# Altium project PCB_Project.PrjPcb
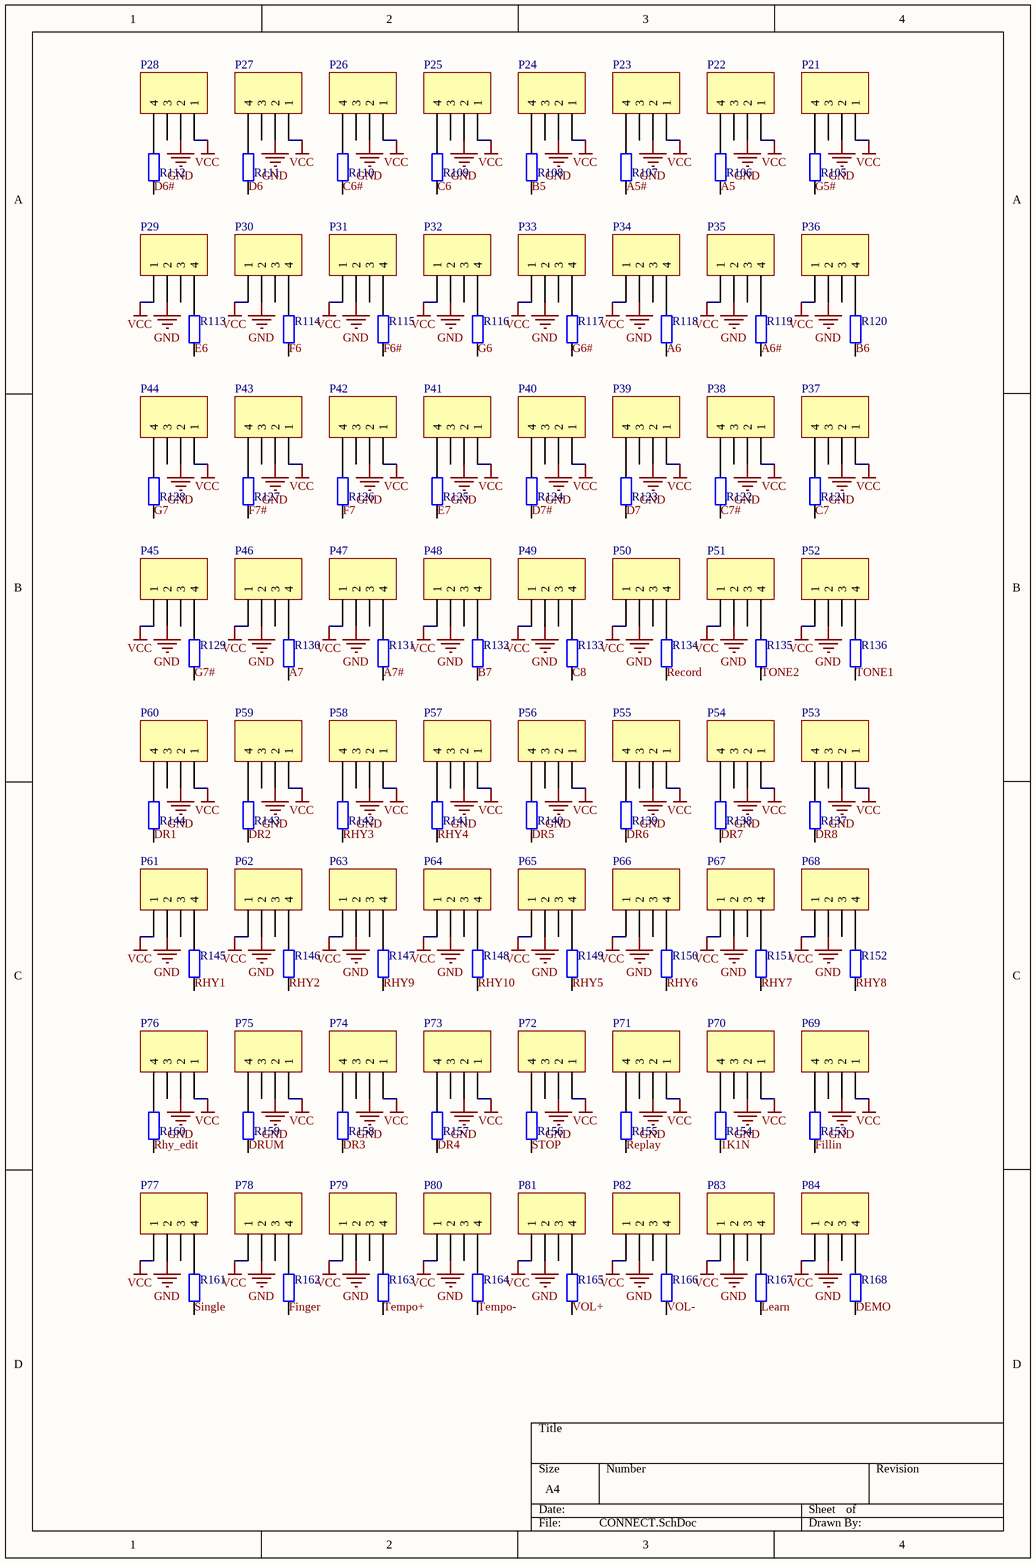
[diagram p0: CONNECT.SchDoc]
3 sheets, 349 parts. Net scope: global (net labels, ports and power ports of the same name join across sheets).
Board file: Connect.PcbDoc
Sheets:
  CONNECT.SchDoc
  CONNECT2.SchDoc
  Sheet3.SchDoc

## Sheet CONNECT.SchDoc
size A4 portrait

### Parts
P21  Header 4  [FPC1.0-2H-WS-4P]  (value not drawn)
P22  Header 4  [FPC1.0-2H-WS-4P]  (value not drawn)
P23  Header 4  [FPC1.0-2H-WS-4P]  (value not drawn)
P24  Header 4  [FPC1.0-2H-WS-4P]  (value not drawn)
P25  Header 4  [FPC1.0-2H-WS-4P]  (value not drawn)
P26  Header 4  [FPC1.0-2H-WS-4P]  (value not drawn)
P27  Header 4  [FPC1.0-2H-WS-4P]  (value not drawn)
P28  Header 4  [FPC1.0-2H-WS-4P]  (value not drawn)
P29  Header 4  [FPC1.0-2H-WS-4P]  (value not drawn)
P30  Header 4  [FPC1.0-2H-WS-4P]  (value not drawn)
P31  Header 4  [FPC1.0-2H-WS-4P]  (value not drawn)
P32  Header 4  [FPC1.0-2H-WS-4P]  (value not drawn)
P33  Header 4  [FPC1.0-2H-WS-4P]  (value not drawn)
P34  Header 4  [FPC1.0-2H-WS-4P]  (value not drawn)
P35  Header 4  [FPC1.0-2H-WS-4P]  (value not drawn)
P36  Header 4  [FPC1.0-2H-WS-4P]  (value not drawn)
P37  Header 4  [FPC1.0-2H-WS-4P]  (value not drawn)
P38  Header 4  [FPC1.0-2H-WS-4P]  (value not drawn)
P39  Header 4  [FPC1.0-2H-WS-4P]  (value not drawn)
P40  Header 4  [FPC1.0-2H-WS-4P]  (value not drawn)
P41  Header 4  [FPC1.0-2H-WS-4P]  (value not drawn)
P42  Header 4  [FPC1.0-2H-WS-4P]  (value not drawn)
P43  Header 4  [FPC1.0-2H-WS-4P]  (value not drawn)
P44  Header 4  [FPC1.0-2H-WS-4P]  (value not drawn)
P45  Header 4  [FPC1.0-2H-WS-4P]  (value not drawn)
P46  Header 4  [FPC1.0-2H-WS-4P]  (value not drawn)
P47  Header 4  [FPC1.0-2H-WS-4P]  (value not drawn)
P48  Header 4  [FPC1.0-2H-WS-4P]  (value not drawn)
P49  Header 4  [FPC1.0-2H-WS-4P]  (value not drawn)
P50  Header 4  [FPC1.0-2H-WS-4P]  (value not drawn)
P51  Header 4  [FPC1.0-2H-WS-4P]  (value not drawn)
P52  Header 4  [FPC1.0-2H-WS-4P]  (value not drawn)
P53  Header 4  [FPC1.0-2H-WS-4P]  (value not drawn)
P54  Header 4  [FPC1.0-2H-WS-4P]  (value not drawn)
P55  Header 4  [FPC1.0-2H-WS-4P]  (value not drawn)
P56  Header 4  [FPC1.0-2H-WS-4P]  (value not drawn)
P57  Header 4  [FPC1.0-2H-WS-4P]  (value not drawn)
P58  Header 4  [FPC1.0-2H-WS-4P]  (value not drawn)
P59  Header 4  [FPC1.0-2H-WS-4P]  (value not drawn)
P60  Header 4  [FPC1.0-2H-WS-4P]  (value not drawn)
P61  Header 4  [FPC1.0-2H-WS-4P]  (value not drawn)
P62  Header 4  [FPC1.0-2H-WS-4P]  (value not drawn)
P63  Header 4  [FPC1.0-2H-WS-4P]  (value not drawn)
P64  Header 4  [FPC1.0-2H-WS-4P]  (value not drawn)
P65  Header 4  [FPC1.0-2H-WS-4P]  (value not drawn)
P66  Header 4  [FPC1.0-2H-WS-4P]  (value not drawn)
P67  Header 4  [FPC1.0-2H-WS-4P]  (value not drawn)
P68  Header 4  [FPC1.0-2H-WS-4P]  (value not drawn)
P69  Header 4  [FPC1.0-2H-WS-4P]  (value not drawn)
P70  Header 4  [FPC1.0-2H-WS-4P]  (value not drawn)
P71  Header 4  [FPC1.0-2H-WS-4P]  (value not drawn)
P72  Header 4  [FPC1.0-2H-WS-4P]  (value not drawn)
P73  Header 4  [FPC1.0-2H-WS-4P]  (value not drawn)
P74  Header 4  [FPC1.0-2H-WS-4P]  (value not drawn)
P75  Header 4  [FPC1.0-2H-WS-4P]  (value not drawn)
P76  Header 4  [FPC1.0-2H-WS-4P]  (value not drawn)
P77  Header 4  [FPC1.0-2H-WS-4P]  (value not drawn)
P78  Header 4  [FPC1.0-2H-WS-4P]  (value not drawn)
P79  Header 4  [FPC1.0-2H-WS-4P]  (value not drawn)
P80  Header 4  [FPC1.0-2H-WS-4P]  (value not drawn)
P81  Header 4  [FPC1.0-2H-WS-4P]  (value not drawn)
P82  Header 4  [FPC1.0-2H-WS-4P]  (value not drawn)
P83  Header 4  [FPC1.0-2H-WS-4P]  (value not drawn)
P84  Header 4  [FPC1.0-2H-WS-4P]  (value not drawn)
R105  1KΩ (1001) ±1%  [0603_R]  (value not drawn)
R106  1KΩ (1001) ±1%  [0603_R]  (value not drawn)
R107  1KΩ (1001) ±1%  [0603_R]  (value not drawn)
R108  1KΩ (1001) ±1%  [0603_R]  (value not drawn)
R109  1KΩ (1001) ±1%  [0603_R]  (value not drawn)
R110  1KΩ (1001) ±1%  [0603_R]  (value not drawn)
R111  1KΩ (1001) ±1%  [0603_R]  (value not drawn)
R112  1KΩ (1001) ±1%  [0603_R]  (value not drawn)
R113  1KΩ (1001) ±1%  [0603_R]  (value not drawn)
R114  1KΩ (1001) ±1%  [0603_R]  (value not drawn)
R115  1KΩ (1001) ±1%  [0603_R]  (value not drawn)
R116  1KΩ (1001) ±1%  [0603_R]  (value not drawn)
R117  1KΩ (1001) ±1%  [0603_R]  (value not drawn)
R118  1KΩ (1001) ±1%  [0603_R]  (value not drawn)
R119  1KΩ (1001) ±1%  [0603_R]  (value not drawn)
R120  1KΩ (1001) ±1%  [0603_R]  (value not drawn)
R121  1KΩ (1001) ±1%  [0603_R]  (value not drawn)
R122  1KΩ (1001) ±1%  [0603_R]  (value not drawn)
R123  1KΩ (1001) ±1%  [0603_R]  (value not drawn)
R124  1KΩ (1001) ±1%  [0603_R]  (value not drawn)
R125  1KΩ (1001) ±1%  [0603_R]  (value not drawn)
R126  1KΩ (1001) ±1%  [0603_R]  (value not drawn)
R127  1KΩ (1001) ±1%  [0603_R]  (value not drawn)
R128  1KΩ (1001) ±1%  [0603_R]  (value not drawn)
R129  1KΩ (1001) ±1%  [0603_R]  (value not drawn)
R130  1KΩ (1001) ±1%  [0603_R]  (value not drawn)
R131  1KΩ (1001) ±1%  [0603_R]  (value not drawn)
R132  1KΩ (1001) ±1%  [0603_R]  (value not drawn)
R133  1KΩ (1001) ±1%  [0603_R]  (value not drawn)
R134  1KΩ (1001) ±1%  [0603_R]  (value not drawn)
R135  1KΩ (1001) ±1%  [0603_R]  (value not drawn)
R136  1KΩ (1001) ±1%  [0603_R]  (value not drawn)
R137  1KΩ (1001) ±1%  [0603_R]  (value not drawn)
R138  1KΩ (1001) ±1%  [0603_R]  (value not drawn)
R139  1KΩ (1001) ±1%  [0603_R]  (value not drawn)
R140  1KΩ (1001) ±1%  [0603_R]  (value not drawn)
R141  1KΩ (1001) ±1%  [0603_R]  (value not drawn)
R142  1KΩ (1001) ±1%  [0603_R]  (value not drawn)
R143  1KΩ (1001) ±1%  [0603_R]  (value not drawn)
R144  1KΩ (1001) ±1%  [0603_R]  (value not drawn)
R145  1KΩ (1001) ±1%  [0603_R]  (value not drawn)
R146  1KΩ (1001) ±1%  [0603_R]  (value not drawn)
R147  1KΩ (1001) ±1%  [0603_R]  (value not drawn)
R148  1KΩ (1001) ±1%  [0603_R]  (value not drawn)
R149  1KΩ (1001) ±1%  [0603_R]  (value not drawn)
R150  1KΩ (1001) ±1%  [0603_R]  (value not drawn)
R151  1KΩ (1001) ±1%  [0603_R]  (value not drawn)
R152  1KΩ (1001) ±1%  [0603_R]  (value not drawn)
R153  1KΩ (1001) ±1%  [0603_R]  (value not drawn)
R154  1KΩ (1001) ±1%  [0603_R]  (value not drawn)
R155  1KΩ (1001) ±1%  [0603_R]  (value not drawn)
R156  1KΩ (1001) ±1%  [0603_R]  (value not drawn)
R157  1KΩ (1001) ±1%  [0603_R]  (value not drawn)
R158  1KΩ (1001) ±1%  [0603_R]  (value not drawn)
R159  1KΩ (1001) ±1%  [0603_R]  (value not drawn)
R160  1KΩ (1001) ±1%  [0603_R]  (value not drawn)
R161  1KΩ (1001) ±1%  [0603_R]  (value not drawn)
R162  1KΩ (1001) ±1%  [0603_R]  (value not drawn)
R163  1KΩ (1001) ±1%  [0603_R]  (value not drawn)
R164  1KΩ (1001) ±1%  [0603_R]  (value not drawn)
R165  1KΩ (1001) ±1%  [0603_R]  (value not drawn)
R166  1KΩ (1001) ±1%  [0603_R]  (value not drawn)
R167  1KΩ (1001) ±1%  [0603_R]  (value not drawn)
R168  1KΩ (1001) ±1%  [0603_R]  (value not drawn)

### Nets
GND: P21.2 P22.2 P23.2 P24.2 P25.2 P26.2 P27.2 P28.2 P29.2 P30.2 P31.2 P32.2 P33.2 P34.2 P35.2 P36.2 P37.2 P38.2 P39.2 P40.2 P41.2 P42.2 P43.2 P44.2 P45.2 P46.2 P47.2 P48.2 P49.2 P50.2 P51.2 P52.2 P53.2 P54.2 P55.2 P56.2 P57.2 P58.2 P59.2 P60.2 P61.2 P62.2 P63.2 P64.2 P65.2 P66.2 P67.2 P68.2 P69.2 P70.2 P71.2 P72.2 P73.2 P74.2 P75.2 P76.2 P77.2 P78.2 P79.2 P80.2 P81.2 P82.2 P83.2 P84.2
VCC: P21.1 P22.1 P23.1 P24.1 P25.1 P26.1 P27.1 P28.1 P29.1 P30.1 P31.1 P32.1 P33.1 P34.1 P35.1 P36.1 P37.1 P38.1 P39.1 P40.1 P41.1 P42.1 P43.1 P44.1 P45.1 P46.1 P47.1 P48.1 P49.1 P50.1 P51.1 P52.1 P53.1 P54.1 P55.1 P56.1 P57.1 P58.1 P59.1 P60.1 P61.1 P62.1 P63.1 P64.1 P65.1 P66.1 P67.1 P68.1 P69.1 P70.1 P71.1 P72.1 P73.1 P74.1 P75.1 P76.1 P77.1 P78.1 P79.1 P80.1 P81.1 P82.1 P83.1 P84.1
1K1N: R154.1
A5: R106.1
A5#: R107.1
A6: R118.1
A6#: R119.1
A7: R130.1
A7#: R131.1
B5: R108.1
B6: R120.1
B7: R132.1
C6: R109.1
C6#: R110.1
C7: R121.1
C7#: R122.1
C8: R133.1
D6: R111.1
D6#: R112.1
D7: R123.1
D7#: R124.1
DEMO: R168.1
DR1: R144.1
DR2: R143.1
DR3: R158.1
DR4: R157.1
DR5: R140.1
DR6: R139.1
DR7: R138.1
DR8: R137.1
DRUM: R159.1
E6: R113.1
E7: R125.1
F6: R114.1
F6#: R115.1
F7: R126.1
F7#: R127.1
Fillin: R153.1
Finger: R162.1
G5#: R105.1
G6: R116.1
G6#: R117.1
G7: R128.1
G7#: R129.1
Learn: R167.1
Record: R134.1
Replay: R155.1
RHY1: R145.1
RHY2: R146.1
RHY3: R142.1
RHY4: R141.1
RHY5: R149.1
RHY6: R150.1
RHY7: R151.1
RHY8: R152.1
RHY9: R147.1
RHY10: R148.1
Rhy_edit: R160.1
Single: R161.1
STOP: R156.1
Tempo+: R163.1
Tempo-: R164.1
TONE1: R136.1
TONE2: R135.1
VOL+: R165.1
VOL-: R166.1
NetP21_4: P21.4 R105.2
NetP22_4: P22.4 R106.2
NetP23_4: P23.4 R107.2
NetP24_4: P24.4 R108.2
NetP25_4: P25.4 R109.2
NetP26_4: P26.4 R110.2
NetP27_4: P27.4 R111.2
NetP28_4: P28.4 R112.2
NetP29_4: P29.4 R113.2
NetP30_4: P30.4 R114.2
NetP31_4: P31.4 R115.2
NetP32_4: P32.4 R116.2
NetP33_4: P33.4 R117.2
NetP34_4: P34.4 R118.2
NetP35_4: P35.4 R119.2
NetP36_4: P36.4 R120.2
NetP37_4: P37.4 R121.2
NetP38_4: P38.4 R122.2
NetP39_4: P39.4 R123.2
NetP40_4: P40.4 R124.2
NetP41_4: P41.4 R125.2
NetP42_4: P42.4 R126.2
NetP43_4: P43.4 R127.2
NetP44_4: P44.4 R128.2
NetP45_4: P45.4 R129.2
NetP46_4: P46.4 R130.2
NetP47_4: P47.4 R131.2
NetP48_4: P48.4 R132.2
NetP49_4: P49.4 R133.2
NetP50_4: P50.4 R134.2
NetP51_4: P51.4 R135.2
NetP52_4: P52.4 R136.2
NetP53_4: P53.4 R137.2
NetP54_4: P54.4 R138.2
NetP55_4: P55.4 R139.2
NetP56_4: P56.4 R140.2
NetP57_4: P57.4 R141.2
NetP58_4: P58.4 R142.2
NetP59_4: P59.4 R143.2
NetP60_4: P60.4 R144.2
NetP61_4: P61.4 R145.2
NetP62_4: P62.4 R146.2
NetP63_4: P63.4 R147.2
NetP64_4: P64.4 R148.2
NetP65_4: P65.4 R149.2
NetP66_4: P66.4 R150.2
NetP67_4: P67.4 R151.2
NetP68_4: P68.4 R152.2
NetP69_4: P69.4 R153.2
NetP70_4: P70.4 R154.2
NetP71_4: P71.4 R155.2
NetP72_4: P72.4 R156.2
NetP73_4: P73.4 R157.2
NetP74_4: P74.4 R158.2
NetP75_4: P75.4 R159.2
NetP76_4: P76.4 R160.2
NetP77_4: P77.4 R161.2
NetP78_4: P78.4 R162.2
NetP79_4: P79.4 R163.2
NetP80_4: P80.4 R164.2
NetP81_4: P81.4 R165.2
NetP82_4: P82.4 R166.2
NetP83_4: P83.4 R167.2
NetP84_4: P84.4 R168.2

Not connected (* = marked no-connect by the designer): P21 3; P22 3; P23 3; P24 3; P25 3; P26 3; P27 3; P28 3; P29 3; P30 3; P31 3; P32 3; P33 3; P34 3; P35 3; P36 3; P37 3; P38 3; P39 3; P40 3; P41 3; P42 3; P43 3; P44 3; P45 3; P46 3; P47 3; P48 3; P49 3; P50 3; P51 3; P52 3; P53 3; P54 3; P55 3; P56 3; P57 3; P58 3; P59 3; P60 3; P61 3; P62 3; P63 3; P64 3; P65 3; P66 3; P67 3; P68 3; P69 3; P70 3; P71 3; P72 3; P73 3; P74 3; P75 3; P76 3; P77 3; P78 3; P79 3; P80 3; P81 3; P82 3; P83 3; P84 3

### Library data of the parts
P21-P84 = Header 4: Header, 4-Pin; LatestRevisionDate: 17-Jul-2002; LatestRevisionNote: Re-released for DXP Platform.; Publisher: Altium Limited
R105-R168 = 0603 1KΩ (1001) 1%: 贴片电阻; ComponentLink1Description: 供应商链接; ComponentLink1URL: http://www.szlcsc.com/product/details_21904.html; Package: 0603; Supplier: LC; SuppliersPartNumber: C21190

## Sheet CONNECT2.SchDoc
size A4
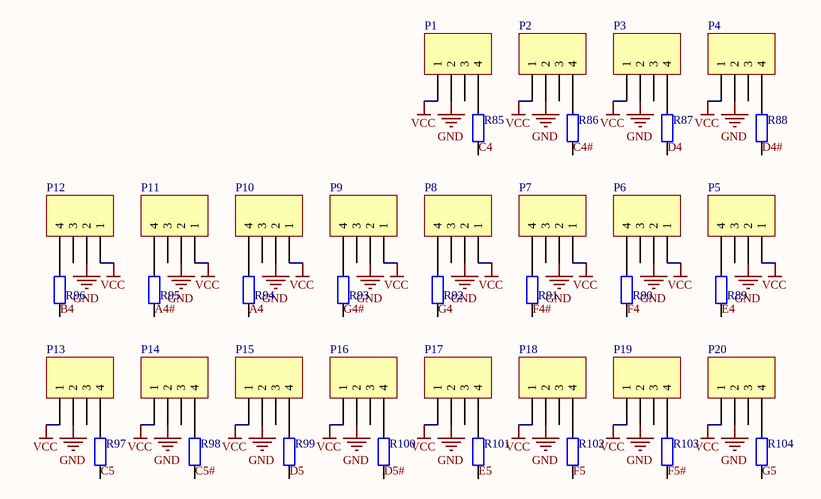
[diagram p1: CONNECT2.SchDoc]

### Parts
P1  Header 4  [FPC1.0-2H-WS-4P]  (value not drawn)
P2  Header 4  [FPC1.0-2H-WS-4P]  (value not drawn)
P3  Header 4  [FPC1.0-2H-WS-4P]  (value not drawn)
P4  Header 4  [FPC1.0-2H-WS-4P]  (value not drawn)
P5  Header 4  [FPC1.0-2H-WS-4P]  (value not drawn)
P6  Header 4  [FPC1.0-2H-WS-4P]  (value not drawn)
P7  Header 4  [FPC1.0-2H-WS-4P]  (value not drawn)
P8  Header 4  [FPC1.0-2H-WS-4P]  (value not drawn)
P9  Header 4  [FPC1.0-2H-WS-4P]  (value not drawn)
P10  Header 4  [FPC1.0-2H-WS-4P]  (value not drawn)
P11  Header 4  [FPC1.0-2H-WS-4P]  (value not drawn)
P12  Header 4  [FPC1.0-2H-WS-4P]  (value not drawn)
P13  Header 4  [FPC1.0-2H-WS-4P]  (value not drawn)
P14  Header 4  [FPC1.0-2H-WS-4P]  (value not drawn)
P15  Header 4  [FPC1.0-2H-WS-4P]  (value not drawn)
P16  Header 4  [FPC1.0-2H-WS-4P]  (value not drawn)
P17  Header 4  [FPC1.0-2H-WS-4P]  (value not drawn)
P18  Header 4  [FPC1.0-2H-WS-4P]  (value not drawn)
P19  Header 4  [FPC1.0-2H-WS-4P]  (value not drawn)
P20  Header 4  [FPC1.0-2H-WS-4P]  (value not drawn)
R85  1KΩ (1001) ±1%  [0603_R]  (value not drawn)
R86  1KΩ (1001) ±1%  [0603_R]  (value not drawn)
R87  1KΩ (1001) ±1%  [0603_R]  (value not drawn)
R88  1KΩ (1001) ±1%  [0603_R]  (value not drawn)
R89  1KΩ (1001) ±1%  [0603_R]  (value not drawn)
R90  1KΩ (1001) ±1%  [0603_R]  (value not drawn)
R91  1KΩ (1001) ±1%  [0603_R]  (value not drawn)
R92  1KΩ (1001) ±1%  [0603_R]  (value not drawn)
R93  1KΩ (1001) ±1%  [0603_R]  (value not drawn)
R94  1KΩ (1001) ±1%  [0603_R]  (value not drawn)
R95  1KΩ (1001) ±1%  [0603_R]  (value not drawn)
R96  1KΩ (1001) ±1%  [0603_R]  (value not drawn)
R97  1KΩ (1001) ±1%  [0603_R]  (value not drawn)
R98  1KΩ (1001) ±1%  [0603_R]  (value not drawn)
R99  1KΩ (1001) ±1%  [0603_R]  (value not drawn)
R100  1KΩ (1001) ±1%  [0603_R]  (value not drawn)
R101  1KΩ (1001) ±1%  [0603_R]  (value not drawn)
R102  1KΩ (1001) ±1%  [0603_R]  (value not drawn)
R103  1KΩ (1001) ±1%  [0603_R]  (value not drawn)
R104  1KΩ (1001) ±1%  [0603_R]  (value not drawn)

### Nets
GND: P1.2 P2.2 P3.2 P4.2 P5.2 P6.2 P7.2 P8.2 P9.2 P10.2 P11.2 P12.2 P13.2 P14.2 P15.2 P16.2 P17.2 P18.2 P19.2 P20.2
VCC: P1.1 P2.1 P3.1 P4.1 P5.1 P6.1 P7.1 P8.1 P9.1 P10.1 P11.1 P12.1 P13.1 P14.1 P15.1 P16.1 P17.1 P18.1 P19.1 P20.1
A4: R94.1
A4#: R95.1
B4: R96.1
C4: R85.1
C4#: R86.1
C5: R97.1
C5#: R98.1
D4: R87.1
D4#: R88.1
D5: R99.1
D5#: R100.1
E4: R89.1
E5: R101.1
F4: R90.1
F4#: R91.1
F5: R102.1
F5#: R103.1
G4: R92.1
G4#: R93.1
G5: R104.1
NetP1_4: P1.4 R85.2
NetP2_4: P2.4 R86.2
NetP3_4: P3.4 R87.2
NetP4_4: P4.4 R88.2
NetP5_4: P5.4 R89.2
NetP6_4: P6.4 R90.2
NetP7_4: P7.4 R91.2
NetP8_4: P8.4 R92.2
NetP9_4: P9.4 R93.2
NetP10_4: P10.4 R94.2
NetP11_4: P11.4 R95.2
NetP12_4: P12.4 R96.2
NetP13_4: P13.4 R97.2
NetP14_4: P14.4 R98.2
NetP15_4: P15.4 R99.2
NetP16_4: P16.4 R100.2
NetP17_4: P17.4 R101.2
NetP18_4: P18.4 R102.2
NetP19_4: P19.4 R103.2
NetP20_4: P20.4 R104.2

Not connected (* = marked no-connect by the designer): P1 3; P2 3; P3 3; P4 3; P5 3; P6 3; P7 3; P8 3; P9 3; P10 3; P11 3; P12 3; P13 3; P14 3; P15 3; P16 3; P17 3; P18 3; P19 3; P20 3

### Library data of the parts
P1-P20 = Header 4: Header, 4-Pin; LatestRevisionDate: 17-Jul-2002; LatestRevisionNote: Re-released for DXP Platform.; Publisher: Altium Limited
R85-R104 = 0603 1KΩ (1001) 1%: 贴片电阻; ComponentLink1Description: 供应商链接; ComponentLink1URL: http://www.szlcsc.com/product/details_21904.html; Package: 0603; Supplier: LC; SuppliersPartNumber: C21190

## Sheet Sheet3.SchDoc
size A4 portrait
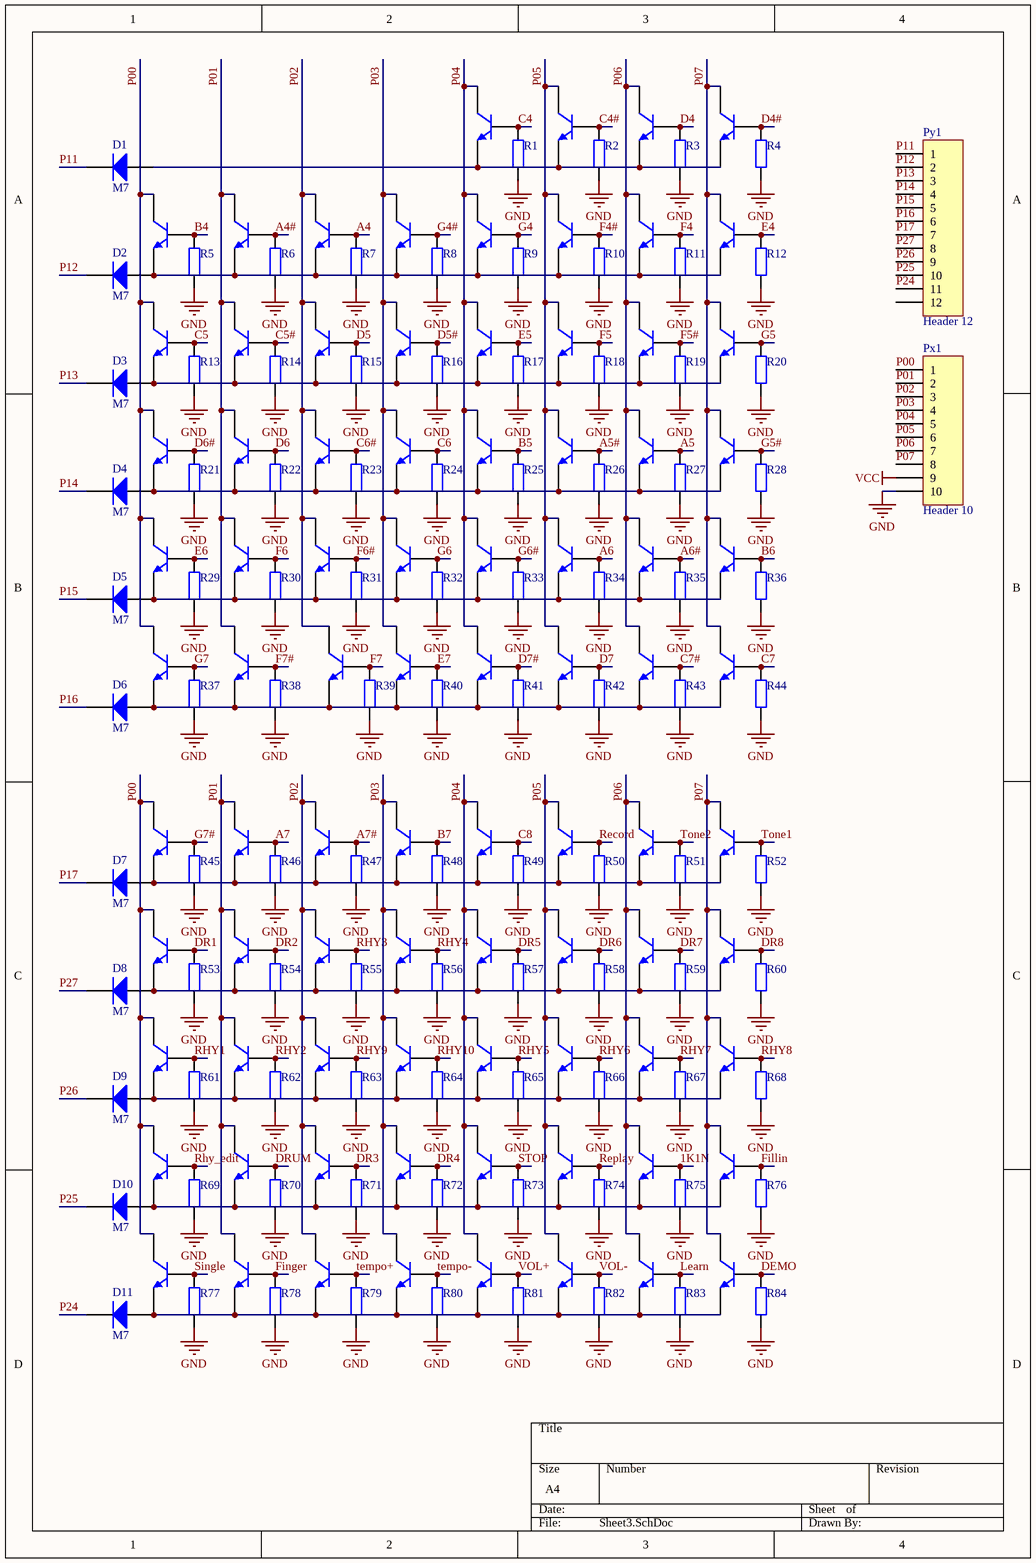
[diagram p2: Sheet3.SchDoc]

### Parts
D1  M7  [SMA(DO-214AC)_S1]
D2  M7  [SMA(DO-214AC)_S1]
D3  M7  [SMA(DO-214AC)_S1]
D4  M7  [SMA(DO-214AC)_S1]
D5  M7  [SMA(DO-214AC)_S1]
D6  M7  [SMA(DO-214AC)_S1]
D7  M7  [SMA(DO-214AC)_S1]
D8  M7  [SMA(DO-214AC)_S1]
D9  M7  [SMA(DO-214AC)_S1]
D10  M7  [SMA(DO-214AC)_S1]
D11  M7  [SMA(DO-214AC)_S1]
Px1  Header 10  [FPC1.0-2H-WS-10P]
Py1  Header 12  [FPC1.0-2H-WS-12P]
Q1  SS8050 Y1  [SOT-23(SOT-23-3)]  (value not drawn)
Q2  SS8050 Y1  [SOT-23(SOT-23-3)]  (value not drawn)
Q3  SS8050 Y1  [SOT-23(SOT-23-3)]  (value not drawn)
Q4  SS8050 Y1  [SOT-23(SOT-23-3)]  (value not drawn)
Q5  SS8050 Y1  [SOT-23(SOT-23-3)]  (value not drawn)
Q6  SS8050 Y1  [SOT-23(SOT-23-3)]  (value not drawn)
Q7  SS8050 Y1  [SOT-23(SOT-23-3)]  (value not drawn)
Q8  SS8050 Y1  [SOT-23(SOT-23-3)]  (value not drawn)
Q9  SS8050 Y1  [SOT-23(SOT-23-3)]  (value not drawn)
Q10  SS8050 Y1  [SOT-23(SOT-23-3)]  (value not drawn)
Q11  SS8050 Y1  [SOT-23(SOT-23-3)]  (value not drawn)
Q12  SS8050 Y1  [SOT-23(SOT-23-3)]  (value not drawn)
Q13  SS8050 Y1  [SOT-23(SOT-23-3)]  (value not drawn)
Q14  SS8050 Y1  [SOT-23(SOT-23-3)]  (value not drawn)
Q15  SS8050 Y1  [SOT-23(SOT-23-3)]  (value not drawn)
Q16  SS8050 Y1  [SOT-23(SOT-23-3)]  (value not drawn)
Q17  SS8050 Y1  [SOT-23(SOT-23-3)]  (value not drawn)
Q18  SS8050 Y1  [SOT-23(SOT-23-3)]  (value not drawn)
Q19  SS8050 Y1  [SOT-23(SOT-23-3)]  (value not drawn)
Q20  SS8050 Y1  [SOT-23(SOT-23-3)]  (value not drawn)
Q21  SS8050 Y1  [SOT-23(SOT-23-3)]  (value not drawn)
Q22  SS8050 Y1  [SOT-23(SOT-23-3)]  (value not drawn)
Q23  SS8050 Y1  [SOT-23(SOT-23-3)]  (value not drawn)
Q24  SS8050 Y1  [SOT-23(SOT-23-3)]  (value not drawn)
Q25  SS8050 Y1  [SOT-23(SOT-23-3)]  (value not drawn)
Q26  SS8050 Y1  [SOT-23(SOT-23-3)]  (value not drawn)
Q27  SS8050 Y1  [SOT-23(SOT-23-3)]  (value not drawn)
Q28  SS8050 Y1  [SOT-23(SOT-23-3)]  (value not drawn)
Q29  SS8050 Y1  [SOT-23(SOT-23-3)]  (value not drawn)
Q30  SS8050 Y1  [SOT-23(SOT-23-3)]  (value not drawn)
Q31  SS8050 Y1  [SOT-23(SOT-23-3)]  (value not drawn)
Q32  SS8050 Y1  [SOT-23(SOT-23-3)]  (value not drawn)
Q33  SS8050 Y1  [SOT-23(SOT-23-3)]  (value not drawn)
Q34  SS8050 Y1  [SOT-23(SOT-23-3)]  (value not drawn)
Q35  SS8050 Y1  [SOT-23(SOT-23-3)]  (value not drawn)
Q36  SS8050 Y1  [SOT-23(SOT-23-3)]  (value not drawn)
Q37  SS8050 Y1  [SOT-23(SOT-23-3)]  (value not drawn)
Q38  SS8050 Y1  [SOT-23(SOT-23-3)]  (value not drawn)
Q39  SS8050 Y1  [SOT-23(SOT-23-3)]  (value not drawn)
Q40  SS8050 Y1  [SOT-23(SOT-23-3)]  (value not drawn)
Q41  SS8050 Y1  [SOT-23(SOT-23-3)]  (value not drawn)
Q42  SS8050 Y1  [SOT-23(SOT-23-3)]  (value not drawn)
Q43  SS8050 Y1  [SOT-23(SOT-23-3)]  (value not drawn)
Q44  SS8050 Y1  [SOT-23(SOT-23-3)]  (value not drawn)
Q45  SS8050 Y1  [SOT-23(SOT-23-3)]  (value not drawn)
Q46  SS8050 Y1  [SOT-23(SOT-23-3)]  (value not drawn)
Q47  SS8050 Y1  [SOT-23(SOT-23-3)]  (value not drawn)
Q48  SS8050 Y1  [SOT-23(SOT-23-3)]  (value not drawn)
Q49  SS8050 Y1  [SOT-23(SOT-23-3)]  (value not drawn)
Q50  SS8050 Y1  [SOT-23(SOT-23-3)]  (value not drawn)
Q51  SS8050 Y1  [SOT-23(SOT-23-3)]  (value not drawn)
Q52  SS8050 Y1  [SOT-23(SOT-23-3)]  (value not drawn)
Q53  SS8050 Y1  [SOT-23(SOT-23-3)]  (value not drawn)
Q54  SS8050 Y1  [SOT-23(SOT-23-3)]  (value not drawn)
Q55  SS8050 Y1  [SOT-23(SOT-23-3)]  (value not drawn)
Q56  SS8050 Y1  [SOT-23(SOT-23-3)]  (value not drawn)
Q57  SS8050 Y1  [SOT-23(SOT-23-3)]  (value not drawn)
Q58  SS8050 Y1  [SOT-23(SOT-23-3)]  (value not drawn)
Q59  SS8050 Y1  [SOT-23(SOT-23-3)]  (value not drawn)
Q60  SS8050 Y1  [SOT-23(SOT-23-3)]  (value not drawn)
Q61  SS8050 Y1  [SOT-23(SOT-23-3)]  (value not drawn)
Q62  SS8050 Y1  [SOT-23(SOT-23-3)]  (value not drawn)
Q63  SS8050 Y1  [SOT-23(SOT-23-3)]  (value not drawn)
Q64  SS8050 Y1  [SOT-23(SOT-23-3)]  (value not drawn)
Q65  SS8050 Y1  [SOT-23(SOT-23-3)]  (value not drawn)
Q66  SS8050 Y1  [SOT-23(SOT-23-3)]  (value not drawn)
Q67  SS8050 Y1  [SOT-23(SOT-23-3)]  (value not drawn)
Q68  SS8050 Y1  [SOT-23(SOT-23-3)]  (value not drawn)
Q69  SS8050 Y1  [SOT-23(SOT-23-3)]  (value not drawn)
Q70  SS8050 Y1  [SOT-23(SOT-23-3)]  (value not drawn)
Q71  SS8050 Y1  [SOT-23(SOT-23-3)]  (value not drawn)
Q72  SS8050 Y1  [SOT-23(SOT-23-3)]  (value not drawn)
Q73  SS8050 Y1  [SOT-23(SOT-23-3)]  (value not drawn)
Q74  SS8050 Y1  [SOT-23(SOT-23-3)]  (value not drawn)
Q75  SS8050 Y1  [SOT-23(SOT-23-3)]  (value not drawn)
Q76  SS8050 Y1  [SOT-23(SOT-23-3)]  (value not drawn)
Q77  SS8050 Y1  [SOT-23(SOT-23-3)]  (value not drawn)
Q78  SS8050 Y1  [SOT-23(SOT-23-3)]  (value not drawn)
Q79  SS8050 Y1  [SOT-23(SOT-23-3)]  (value not drawn)
Q80  SS8050 Y1  [SOT-23(SOT-23-3)]  (value not drawn)
Q81  SS8050 Y1  [SOT-23(SOT-23-3)]  (value not drawn)
Q82  SS8050 Y1  [SOT-23(SOT-23-3)]  (value not drawn)
Q83  SS8050 Y1  [SOT-23(SOT-23-3)]  (value not drawn)
Q84  SS8050 Y1  [SOT-23(SOT-23-3)]  (value not drawn)
R1  10KΩ (1002) ±1%  [0603_R]  (value not drawn)
R2  10KΩ (1002) ±1%  [0603_R]  (value not drawn)
R3  10KΩ (1002) ±1%  [0603_R]  (value not drawn)
R4  10KΩ (1002) ±1%  [0603_R]  (value not drawn)
R5  10KΩ (1002) ±1%  [0603_R]  (value not drawn)
R6  10KΩ (1002) ±1%  [0603_R]  (value not drawn)
R7  10KΩ (1002) ±1%  [0603_R]  (value not drawn)
R8  10KΩ (1002) ±1%  [0603_R]  (value not drawn)
R9  10KΩ (1002) ±1%  [0603_R]  (value not drawn)
R10  10KΩ (1002) ±1%  [0603_R]  (value not drawn)
R11  10KΩ (1002) ±1%  [0603_R]  (value not drawn)
R12  10KΩ (1002) ±1%  [0603_R]  (value not drawn)
R13  10KΩ (1002) ±1%  [0603_R]  (value not drawn)
R14  10KΩ (1002) ±1%  [0603_R]  (value not drawn)
R15  10KΩ (1002) ±1%  [0603_R]  (value not drawn)
R16  10KΩ (1002) ±1%  [0603_R]  (value not drawn)
R17  10KΩ (1002) ±1%  [0603_R]  (value not drawn)
R18  10KΩ (1002) ±1%  [0603_R]  (value not drawn)
R19  10KΩ (1002) ±1%  [0603_R]  (value not drawn)
R20  10KΩ (1002) ±1%  [0603_R]  (value not drawn)
R21  10KΩ (1002) ±1%  [0603_R]  (value not drawn)
R22  10KΩ (1002) ±1%  [0603_R]  (value not drawn)
R23  10KΩ (1002) ±1%  [0603_R]  (value not drawn)
R24  10KΩ (1002) ±1%  [0603_R]  (value not drawn)
R25  10KΩ (1002) ±1%  [0603_R]  (value not drawn)
R26  10KΩ (1002) ±1%  [0603_R]  (value not drawn)
R27  10KΩ (1002) ±1%  [0603_R]  (value not drawn)
R28  10KΩ (1002) ±1%  [0603_R]  (value not drawn)
R29  10KΩ (1002) ±1%  [0603_R]  (value not drawn)
R30  10KΩ (1002) ±1%  [0603_R]  (value not drawn)
R31  10KΩ (1002) ±1%  [0603_R]  (value not drawn)
R32  10KΩ (1002) ±1%  [0603_R]  (value not drawn)
R33  10KΩ (1002) ±1%  [0603_R]  (value not drawn)
R34  10KΩ (1002) ±1%  [0603_R]  (value not drawn)
R35  10KΩ (1002) ±1%  [0603_R]  (value not drawn)
R36  10KΩ (1002) ±1%  [0603_R]  (value not drawn)
R37  10KΩ (1002) ±1%  [0603_R]  (value not drawn)
R38  10KΩ (1002) ±1%  [0603_R]  (value not drawn)
R39  10KΩ (1002) ±1%  [0603_R]  (value not drawn)
R40  10KΩ (1002) ±1%  [0603_R]  (value not drawn)
R41  10KΩ (1002) ±1%  [0603_R]  (value not drawn)
R42  10KΩ (1002) ±1%  [0603_R]  (value not drawn)
R43  10KΩ (1002) ±1%  [0603_R]  (value not drawn)
R44  10KΩ (1002) ±1%  [0603_R]  (value not drawn)
R45  10KΩ (1002) ±1%  [0603_R]  (value not drawn)
R46  10KΩ (1002) ±1%  [0603_R]  (value not drawn)
R47  10KΩ (1002) ±1%  [0603_R]  (value not drawn)
R48  10KΩ (1002) ±1%  [0603_R]  (value not drawn)
R49  10KΩ (1002) ±1%  [0603_R]  (value not drawn)
R50  10KΩ (1002) ±1%  [0603_R]  (value not drawn)
R51  10KΩ (1002) ±1%  [0603_R]  (value not drawn)
R52  10KΩ (1002) ±1%  [0603_R]  (value not drawn)
R53  10KΩ (1002) ±1%  [0603_R]  (value not drawn)
R54  10KΩ (1002) ±1%  [0603_R]  (value not drawn)
R55  10KΩ (1002) ±1%  [0603_R]  (value not drawn)
R56  10KΩ (1002) ±1%  [0603_R]  (value not drawn)
R57  10KΩ (1002) ±1%  [0603_R]  (value not drawn)
R58  10KΩ (1002) ±1%  [0603_R]  (value not drawn)
R59  10KΩ (1002) ±1%  [0603_R]  (value not drawn)
R60  10KΩ (1002) ±1%  [0603_R]  (value not drawn)
R61  10KΩ (1002) ±1%  [0603_R]  (value not drawn)
R62  10KΩ (1002) ±1%  [0603_R]  (value not drawn)
R63  10KΩ (1002) ±1%  [0603_R]  (value not drawn)
R64  10KΩ (1002) ±1%  [0603_R]  (value not drawn)
R65  10KΩ (1002) ±1%  [0603_R]  (value not drawn)
R66  10KΩ (1002) ±1%  [0603_R]  (value not drawn)
R67  10KΩ (1002) ±1%  [0603_R]  (value not drawn)
R68  10KΩ (1002) ±1%  [0603_R]  (value not drawn)
R69  10KΩ (1002) ±1%  [0603_R]  (value not drawn)
R70  10KΩ (1002) ±1%  [0603_R]  (value not drawn)
R71  10KΩ (1002) ±1%  [0603_R]  (value not drawn)
R72  10KΩ (1002) ±1%  [0603_R]  (value not drawn)
R73  10KΩ (1002) ±1%  [0603_R]  (value not drawn)
R74  10KΩ (1002) ±1%  [0603_R]  (value not drawn)
R75  10KΩ (1002) ±1%  [0603_R]  (value not drawn)
R76  10KΩ (1002) ±1%  [0603_R]  (value not drawn)
R77  10KΩ (1002) ±1%  [0603_R]  (value not drawn)
R78  10KΩ (1002) ±1%  [0603_R]  (value not drawn)
R79  10KΩ (1002) ±1%  [0603_R]  (value not drawn)
R80  10KΩ (1002) ±1%  [0603_R]  (value not drawn)
R81  10KΩ (1002) ±1%  [0603_R]  (value not drawn)
R82  10KΩ (1002) ±1%  [0603_R]  (value not drawn)
R83  10KΩ (1002) ±1%  [0603_R]  (value not drawn)
R84  10KΩ (1002) ±1%  [0603_R]  (value not drawn)

### Nets
GND: Px1.10 R1.1 R2.1 R3.1 R4.1 R5.1 R6.1 R7.1 R8.1 R9.1 R10.1 R11.1 R12.1 R13.1 R14.1 R15.1 R16.1 R17.1 R18.1 R19.1 R20.1 R21.1 R22.1 R23.1 R24.1 R25.1 R26.1 R27.1 R28.1 R29.1 R30.1 R31.1 R32.1 R33.1 R34.1 R35.1 R36.1 R37.1 R38.1 R39.1 R40.1 R41.1 R42.1 R43.1 R44.1 R45.1 R46.1 R47.1 R48.1 R49.1 R50.1 R51.1 R52.1 R53.1 R54.1 R55.1 R56.1 R57.1 R58.1 R59.1 R60.1 R61.1 R62.1 R63.1 R64.1 R65.1 R66.1 R67.1 R68.1 R69.1 R70.1 R71.1 R72.1 R73.1 R74.1 R75.1 R76.1 R77.1 R78.1 R79.1 R80.1 R81.1 R82.1 R83.1 R84.1
VCC: Px1.9
1K1N: Q75.1(B) R75.2
A4: Q7.1(B) R7.2
A4#: Q6.1(B) R6.2
A5: Q27.1(B) R27.2
A5#: Q26.1(B) R26.2
A6: Q34.1(B) R34.2
A6#: Q35.1(B) R35.2
A7: Q46.1(B) R46.2
A7#: Q47.1(B) R47.2
B4: Q5.1(B) R5.2
B5: Q25.1(B) R25.2
B6: Q36.1(B) R36.2
B7: Q48.1(B) R48.2
C4: Q1.1(B) R1.2
C4#: Q2.1(B) R2.2
C5: Q13.1(B) R13.2
C5#: Q14.1(B) R14.2
C6: Q24.1(B) R24.2
C6#: Q23.1(B) R23.2
C7: Q44.1(B) R44.2
C7#: Q43.1(B) R43.2
C8: Q49.1(B) R49.2
D4: Q3.1(B) R3.2
D4#: Q4.1(B) R4.2
D5: Q15.1(B) R15.2
D5#: Q16.1(B) R16.2
D6: Q22.1(B) R22.2
D6#: Q21.1(B) R21.2
D7: Q42.1(B) R42.2
D7#: Q41.1(B) R41.2
DEMO: Q84.1(B) R84.2
DR1: Q53.1(B) R53.2
DR2: Q54.1(B) R54.2
DR3: Q71.1(B) R71.2
DR4: Q72.1(B) R72.2
DR5: Q57.1(B) R57.2
DR6: Q58.1(B) R58.2
DR7: Q59.1(B) R59.2
DR8: Q60.1(B) R60.2
DRUM: Q70.1(B) R70.2
E4: Q12.1(B) R12.2
E5: Q17.1(B) R17.2
E6: Q29.1(B) R29.2
E7: Q40.1(B) R40.2
F4: Q11.1(B) R11.2
F4#: Q10.1(B) R10.2
F5: Q18.1(B) R18.2
F5#: Q19.1(B) R19.2
F6: Q30.1(B) R30.2
F6#: Q31.1(B) R31.2
F7: Q39.1(B) R39.2
F7#: Q38.1(B) R38.2
Fillin: Q76.1(B) R76.2
Finger: Q78.1(B) R78.2
G4: Q9.1(B) R9.2
G4#: Q8.1(B) R8.2
G5: Q20.1(B) R20.2
G5#: Q28.1(B) R28.2
G6: Q32.1(B) R32.2
G6#: Q33.1(B) R33.2
G7: Q37.1(B) R37.2
G7#: Q45.1(B) R45.2
Learn: Q83.1(B) R83.2
P00: Px1.1 Q5.3(C) Q13.3(C) Q21.3(C) Q29.3(C) Q37.3(C) Q45.3(C) Q53.3(C) Q61.3(C) Q69.3(C) Q77.3(C)
P01: Px1.2 Q6.3(C) Q14.3(C) Q22.3(C) Q30.3(C) Q38.3(C) Q46.3(C) Q54.3(C) Q62.3(C) Q70.3(C) Q78.3(C)
P02: Px1.3 Q7.3(C) Q15.3(C) Q23.3(C) Q31.3(C) Q39.3(C) Q47.3(C) Q55.3(C) Q63.3(C) Q71.3(C) Q79.3(C)
P03: Px1.4 Q8.3(C) Q16.3(C) Q24.3(C) Q32.3(C) Q40.3(C) Q48.3(C) Q56.3(C) Q64.3(C) Q72.3(C) Q80.3(C)
P04: Px1.5 Q1.3(C) Q9.3(C) Q17.3(C) Q25.3(C) Q33.3(C) Q41.3(C) Q49.3(C) Q57.3(C) Q65.3(C) Q73.3(C) Q81.3(C)
P05: Px1.6 Q2.3(C) Q10.3(C) Q18.3(C) Q26.3(C) Q34.3(C) Q42.3(C) Q50.3(C) Q58.3(C) Q66.3(C) Q74.3(C) Q82.3(C)
P06: Px1.7 Q3.3(C) Q11.3(C) Q19.3(C) Q27.3(C) Q35.3(C) Q43.3(C) Q51.3(C) Q59.3(C) Q67.3(C) Q75.3(C) Q83.3(C)
P07: Px1.8 Q4.3(C) Q12.3(C) Q20.3(C) Q28.3(C) Q36.3(C) Q44.3(C) Q52.3(C) Q60.3(C) Q68.3(C) Q76.3(C) Q84.3(C)
P11: D1.2(K) Py1.1
P12: D2.2(K) Py1.2
P13: D3.2(K) Py1.3
P14: D4.2(K) Py1.4
P15: D5.2(K) Py1.5
P16: D6.2(K) Py1.6
P17: D7.2(K) Py1.7
P24: D11.2(K) Py1.11
P25: D10.2(K) Py1.10
P26: D9.2(K) Py1.9
P27: D8.2(K) Py1.8
Record: Q50.1(B) R50.2
Replay: Q74.1(B) R74.2
RHY1: Q61.1(B) R61.2
RHY2: Q62.1(B) R62.2
RHY3: Q55.1(B) R55.2
RHY4: Q56.1(B) R56.2
RHY5: Q65.1(B) R65.2
RHY6: Q66.1(B) R66.2
RHY7: Q67.1(B) R67.2
RHY8: Q68.1(B) R68.2
RHY9: Q63.1(B) R63.2
RHY10: Q64.1(B) R64.2
Rhy_edit: Q69.1(B) R69.2
Single: Q77.1(B) R77.2
STOP: Q73.1(B) R73.2
Tempo+: Q79.1(B) R79.2
Tempo-: Q80.1(B) R80.2
TONE1: Q52.1(B) R52.2
TONE2: Q51.1(B) R51.2
VOL+: Q81.1(B) R81.2
VOL-: Q82.1(B) R82.2
NetD1_1: D1.1(A) Q1.2(E) Q2.2(E) Q3.2(E) Q4.2(E)
NetD2_1: D2.1(A) Q5.2(E) Q6.2(E) Q7.2(E) Q8.2(E) Q9.2(E) Q10.2(E) Q11.2(E) Q12.2(E)
NetD3_1: D3.1(A) Q13.2(E) Q14.2(E) Q15.2(E) Q16.2(E) Q17.2(E) Q18.2(E) Q19.2(E) Q20.2(E)
NetD4_1: D4.1(A) Q21.2(E) Q22.2(E) Q23.2(E) Q24.2(E) Q25.2(E) Q26.2(E) Q27.2(E) Q28.2(E)
NetD5_1: D5.1(A) Q29.2(E) Q30.2(E) Q31.2(E) Q32.2(E) Q33.2(E) Q34.2(E) Q35.2(E) Q36.2(E)
NetD6_1: D6.1(A) Q37.2(E) Q38.2(E) Q39.2(E) Q40.2(E) Q41.2(E) Q42.2(E) Q43.2(E) Q44.2(E)
NetD7_1: D7.1(A) Q45.2(E) Q46.2(E) Q47.2(E) Q48.2(E) Q49.2(E) Q50.2(E) Q51.2(E) Q52.2(E)
NetD8_1: D8.1(A) Q53.2(E) Q54.2(E) Q55.2(E) Q56.2(E) Q57.2(E) Q58.2(E) Q59.2(E) Q60.2(E)
NetD9_1: D9.1(A) Q61.2(E) Q62.2(E) Q63.2(E) Q64.2(E) Q65.2(E) Q66.2(E) Q67.2(E) Q68.2(E)
NetD10_1: D10.1(A) Q69.2(E) Q70.2(E) Q71.2(E) Q72.2(E) Q73.2(E) Q74.2(E) Q75.2(E) Q76.2(E)
NetD11_1: D11.1(A) Q77.2(E) Q78.2(E) Q79.2(E) Q80.2(E) Q81.2(E) Q82.2(E) Q83.2(E) Q84.2(E)

Not connected (* = marked no-connect by the designer): Py1 12

### Library data of the parts
D1-D11 = SMA(DO-214AC) M7: 二极管; 备注: 1N4007 4007 编号C2464 已经停售, 使用新物料编号C95872; ComponentLink1Description: 供应商链接; ComponentLink1URL: http://www.szlcsc.com/product/details_2841.html; Package: SMA(DO-214AC); Supplier: LC; SuppliersPartNumber: C95872
Px1 = Header 10: Header, 10-Pin; LatestRevisionDate: 17-Jul-2002; LatestRevisionNote: Re-released for DXP Platform.; Publisher: Altium Limited
Py1 = Header 12: Header, 12-Pin; LatestRevisionDate: 17-Jul-2002; LatestRevisionNote: Re-released for DXP Platform.; Publisher: Altium Limited
Q1-Q84 = SOT-23 SS8050 Y1: 三极管; ComponentLink1Description: 供应商链接; ComponentLink1URL: http://www.szlcsc.com/product/details_2507.html; Package: SOT-23; Supplier: LC; SuppliersPartNumber: C2150
R1-R84 = 0603 10KΩ (1002) 1%: 贴片电阻; ComponentLink1Description: 供应商链接; ComponentLink1URL: http://www.szlcsc.com/product/details_26547.html; Package: 0603; Supplier: LC; SuppliersPartNumber: C25804

## Nets that join several sheets
GND: CONNECT (64 pins), CONNECT2 (20 pins), Sheet3 (85 pins)
VCC: CONNECT (64 pins), CONNECT2 (20 pins), Sheet3 (Px1.9)
1K1N: CONNECT (R154.1), Sheet3 (Q75.1 R75.2)
A4: CONNECT2 (R94.1), Sheet3 (Q7.1 R7.2)
A4#: CONNECT2 (R95.1), Sheet3 (Q6.1 R6.2)
A5: CONNECT (R106.1), Sheet3 (Q27.1 R27.2)
A5#: CONNECT (R107.1), Sheet3 (Q26.1 R26.2)
A6: CONNECT (R118.1), Sheet3 (Q34.1 R34.2)
A6#: CONNECT (R119.1), Sheet3 (Q35.1 R35.2)
A7: CONNECT (R130.1), Sheet3 (Q46.1 R46.2)
A7#: CONNECT (R131.1), Sheet3 (Q47.1 R47.2)
B4: CONNECT2 (R96.1), Sheet3 (Q5.1 R5.2)
B5: CONNECT (R108.1), Sheet3 (Q25.1 R25.2)
B6: CONNECT (R120.1), Sheet3 (Q36.1 R36.2)
B7: CONNECT (R132.1), Sheet3 (Q48.1 R48.2)
C4: CONNECT2 (R85.1), Sheet3 (Q1.1 R1.2)
C4#: CONNECT2 (R86.1), Sheet3 (Q2.1 R2.2)
C5: CONNECT2 (R97.1), Sheet3 (Q13.1 R13.2)
C5#: CONNECT2 (R98.1), Sheet3 (Q14.1 R14.2)
C6: CONNECT (R109.1), Sheet3 (Q24.1 R24.2)
C6#: CONNECT (R110.1), Sheet3 (Q23.1 R23.2)
C7: CONNECT (R121.1), Sheet3 (Q44.1 R44.2)
C7#: CONNECT (R122.1), Sheet3 (Q43.1 R43.2)
C8: CONNECT (R133.1), Sheet3 (Q49.1 R49.2)
D4: CONNECT2 (R87.1), Sheet3 (Q3.1 R3.2)
D4#: CONNECT2 (R88.1), Sheet3 (Q4.1 R4.2)
D5: CONNECT2 (R99.1), Sheet3 (Q15.1 R15.2)
D5#: CONNECT2 (R100.1), Sheet3 (Q16.1 R16.2)
D6: CONNECT (R111.1), Sheet3 (Q22.1 R22.2)
D6#: CONNECT (R112.1), Sheet3 (Q21.1 R21.2)
D7: CONNECT (R123.1), Sheet3 (Q42.1 R42.2)
D7#: CONNECT (R124.1), Sheet3 (Q41.1 R41.2)
DEMO: CONNECT (R168.1), Sheet3 (Q84.1 R84.2)
DR1: CONNECT (R144.1), Sheet3 (Q53.1 R53.2)
DR2: CONNECT (R143.1), Sheet3 (Q54.1 R54.2)
DR3: CONNECT (R158.1), Sheet3 (Q71.1 R71.2)
DR4: CONNECT (R157.1), Sheet3 (Q72.1 R72.2)
DR5: CONNECT (R140.1), Sheet3 (Q57.1 R57.2)
DR6: CONNECT (R139.1), Sheet3 (Q58.1 R58.2)
DR7: CONNECT (R138.1), Sheet3 (Q59.1 R59.2)
DR8: CONNECT (R137.1), Sheet3 (Q60.1 R60.2)
DRUM: CONNECT (R159.1), Sheet3 (Q70.1 R70.2)
E4: CONNECT2 (R89.1), Sheet3 (Q12.1 R12.2)
E5: CONNECT2 (R101.1), Sheet3 (Q17.1 R17.2)
E6: CONNECT (R113.1), Sheet3 (Q29.1 R29.2)
E7: CONNECT (R125.1), Sheet3 (Q40.1 R40.2)
F4: CONNECT2 (R90.1), Sheet3 (Q11.1 R11.2)
F4#: CONNECT2 (R91.1), Sheet3 (Q10.1 R10.2)
F5: CONNECT2 (R102.1), Sheet3 (Q18.1 R18.2)
F5#: CONNECT2 (R103.1), Sheet3 (Q19.1 R19.2)
F6: CONNECT (R114.1), Sheet3 (Q30.1 R30.2)
F6#: CONNECT (R115.1), Sheet3 (Q31.1 R31.2)
F7: CONNECT (R126.1), Sheet3 (Q39.1 R39.2)
F7#: CONNECT (R127.1), Sheet3 (Q38.1 R38.2)
Fillin: CONNECT (R153.1), Sheet3 (Q76.1 R76.2)
Finger: CONNECT (R162.1), Sheet3 (Q78.1 R78.2)
G4: CONNECT2 (R92.1), Sheet3 (Q9.1 R9.2)
G4#: CONNECT2 (R93.1), Sheet3 (Q8.1 R8.2)
G5: CONNECT2 (R104.1), Sheet3 (Q20.1 R20.2)
G5#: CONNECT (R105.1), Sheet3 (Q28.1 R28.2)
G6: CONNECT (R116.1), Sheet3 (Q32.1 R32.2)
G6#: CONNECT (R117.1), Sheet3 (Q33.1 R33.2)
G7: CONNECT (R128.1), Sheet3 (Q37.1 R37.2)
G7#: CONNECT (R129.1), Sheet3 (Q45.1 R45.2)
Learn: CONNECT (R167.1), Sheet3 (Q83.1 R83.2)
Record: CONNECT (R134.1), Sheet3 (Q50.1 R50.2)
Replay: CONNECT (R155.1), Sheet3 (Q74.1 R74.2)
RHY1: CONNECT (R145.1), Sheet3 (Q61.1 R61.2)
RHY2: CONNECT (R146.1), Sheet3 (Q62.1 R62.2)
RHY3: CONNECT (R142.1), Sheet3 (Q55.1 R55.2)
RHY4: CONNECT (R141.1), Sheet3 (Q56.1 R56.2)
RHY5: CONNECT (R149.1), Sheet3 (Q65.1 R65.2)
RHY6: CONNECT (R150.1), Sheet3 (Q66.1 R66.2)
RHY7: CONNECT (R151.1), Sheet3 (Q67.1 R67.2)
RHY8: CONNECT (R152.1), Sheet3 (Q68.1 R68.2)
RHY9: CONNECT (R147.1), Sheet3 (Q63.1 R63.2)
RHY10: CONNECT (R148.1), Sheet3 (Q64.1 R64.2)
Rhy_edit: CONNECT (R160.1), Sheet3 (Q69.1 R69.2)
Single: CONNECT (R161.1), Sheet3 (Q77.1 R77.2)
STOP: CONNECT (R156.1), Sheet3 (Q73.1 R73.2)
Tempo+: CONNECT (R163.1), Sheet3 (Q79.1 R79.2)
Tempo-: CONNECT (R164.1), Sheet3 (Q80.1 R80.2)
TONE1: CONNECT (R136.1), Sheet3 (Q52.1 R52.2)
TONE2: CONNECT (R135.1), Sheet3 (Q51.1 R51.2)
VOL+: CONNECT (R165.1), Sheet3 (Q81.1 R81.2)
VOL-: CONNECT (R166.1), Sheet3 (Q82.1 R82.2)